# EAGLE design pin (EAGLE 8.2.1)
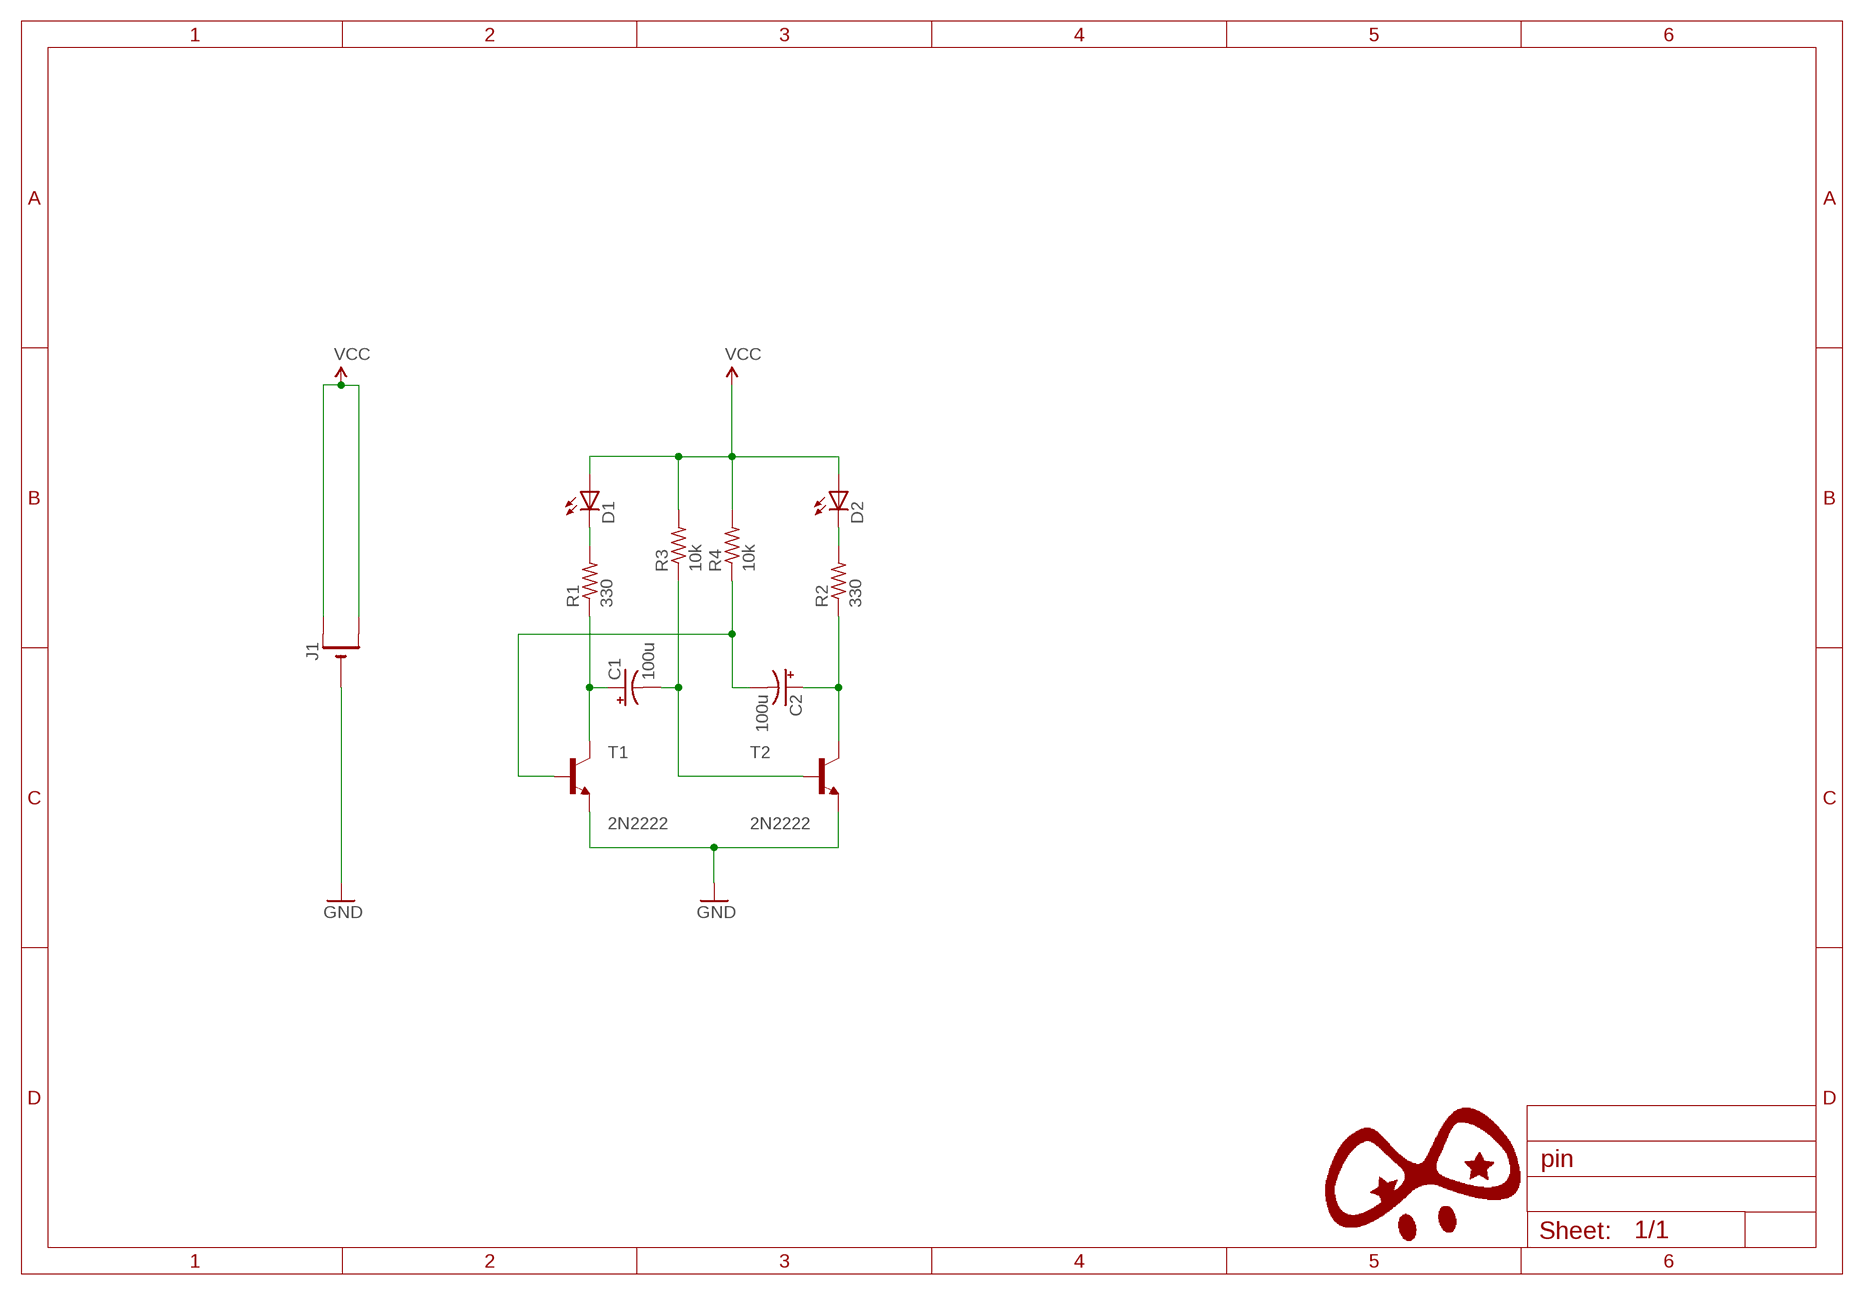
[diagram p0: schematic, sheet 1]

## Parts
C1  100u  CPOL-USE2-5  [E2-5]
C2  100u  CPOL-USE2-5  [E2-5]
D1  LED-3MM  [LED_3MM]
D2  LED-3MM  [LED_3MM]
J1  CR1220SMT  [CR1220-SMD]
R1  330  R-US_0204/5  [0204/5]
R2  330  R-US_0204/5  [0204/5]
R3  10k  R-US_0204/5  [0204/5]
R4  10k  R-US_0204/5  [0204/5]
T1  2N2222  [TO92-EBC-OVAL]
T2  2N2222  [TO92-EBC-OVAL]

## Nets
CP1: C1.+ R1.1 T1.C
GND: J1.- T1.E T2.E
N$3: C2.+ R2.1 T2.C
N$4: C1.- R3.1 T2.B
N$5: C2.- R4.1 T1.B
N$6: D1.C R1.2
N$7: D2.C R2.2
VCC: D1.A D2.A J1.+$1(+) J1.+$2(+1) R3.2 R4.2

## Library data of the parts
C1 C2 = adafruit:CPOL-US: POLARIZED CAPACITOR, American symbol
D1 D2 = Opto:LED: LEDs red, green, blue -> 0603
J1 = adafruit:CR1220: CR1216/CR1220/CR1225 12mm 3V lithium coin cell Great for battery packup. Both SMT and THM holders. Note the THM package has the ground pads on both sides of the PCB so that the masks are the same - this reduces the cost
R1-R4 = adafruit:R-US_: RESISTOR, American symbol
T1 T2 = adafruit:2N2222: NPN TRANSISTOR Big oval pads

## Net classes
0 default: clearance 0.254 mm

## Board
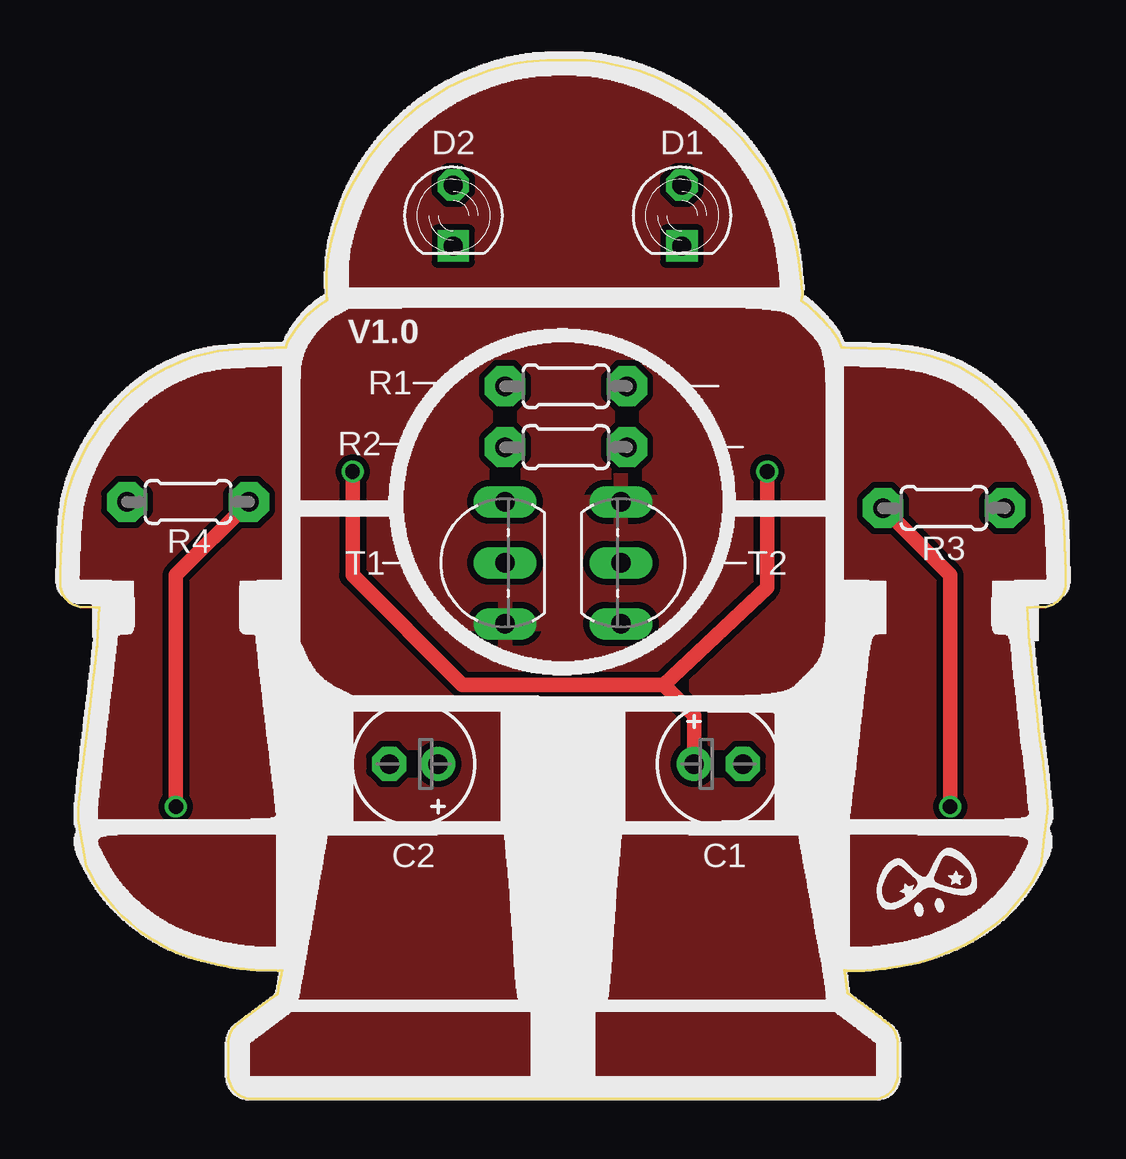
[diagram p1: board, top side]
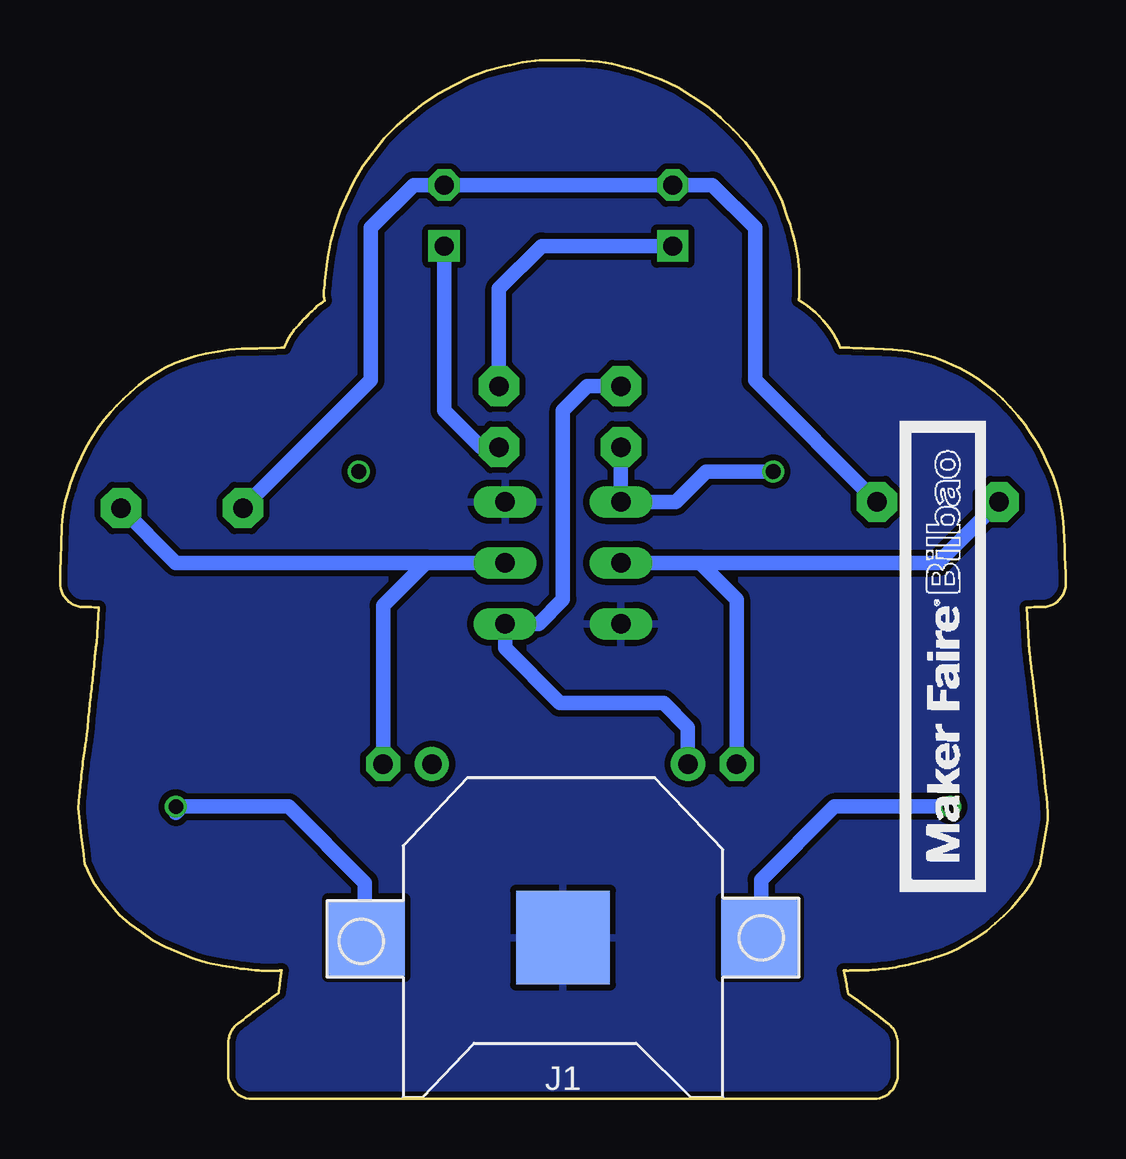
[diagram p2: board, bottom side, seen from below]

Size 41.92 x 43.31 mm. Coordinates in mm from the lower left corner, seen from the top.
Outline: 41.69,20.87 41.73,20.92 41.76,20.98 41.8,21.03 41.83,21.09 41.85,21.15 41.87,21.21 41.89,21.28 41.91,21.4 41.92,21.47 41.91,21.54 41.9,21.91 41.88,22.64 41.87,23.01 41.86,23.35 41.85,23.63 41.83,23.87 41.82,24.1 41.8,24.3 41.78,24.49 41.75,24.67 41.71,24.84 41.62,25.2 41.56,25.4 41.48,25.63 41.35,26.02 41.2,26.4 41.04,26.74 40.87,27.09 40.69,27.42 40.28,28.05 40.06,28.34 39.81,28.63 39.56,28.91 39.29,29.19 38.99,29.45 38.64,29.76 38.28,30.03 37.9,30.26 37.53,30.49 37.13,30.67 36.71,30.82 36.29,30.97 35.84,31.08 35.35,31.16 34.86,31.23 34.34,31.28 33.76,31.29 33.7,31.29 33.6,31.29 33.5,31.29 33.37,31.3 33.09,31.3 32.95,31.31 32.71,31.31 32.61,31.31 32.56,31.31 32.52,31.43 32.48,31.54 32.42,31.65 32.36,31.76 32.3,31.86 32.23,31.96 32.15,32.06 32.07,32.17 31.98,32.27 31.88,32.37 31.78,32.48 31.67,32.6 31.65,32.61 31.64,32.62 31.63,32.64 31.61,32.65 31.6,32.66 31.59,32.67 31.58,32.69 31.57,32.7 31.55,32.71 31.54,32.72 31.53,32.73 31.52,32.74 31.47,32.8 31.42,32.85 31.31,32.95 31.26,33 31.21,33.04 31.16,33.09 31.1,33.13 30.99,33.2 30.94,33.24 30.88,33.27 30.89,33.31 30.9,33.34 30.91,33.4 30.92,33.44 30.92,33.47 30.93,33.5 30.93,33.54 30.93,33.57 30.93,33.6 30.93,33.64 30.92,33.67 30.91,33.81 30.89,33.95 30.88,34.1 30.86,34.24 30.82,34.59 30.78,34.91 30.73,35.21 30.68,35.5 30.63,35.77 30.56,36.03 30.49,36.29 30.42,36.54 30.32,36.79 30.23,37.04 30.12,37.3 30,37.57 29.68,38.25 29.3,38.88 28.4,40.05 27.89,40.57 27.33,41.04 26.77,41.51 26.15,41.91 25.49,42.25 24.83,42.59 24.13,42.85 23.4,43.04 23.18,43.1 22.99,43.14 22.81,43.18 22.64,43.22 22.47,43.24 22.11,43.28 21.92,43.29 21.71,43.3 21.49,43.31 21.25,43.31 20.6,43.31 20.29,43.3 19.71,43.27 19.44,43.24 19.18,43.19 18.92,43.15 18.67,43.09 18.4,43.02 18.13,42.95 17.85,42.85 17.54,42.74 16.84,42.49 16.18,42.17 14.95,41.38 14.38,40.91 13.87,40.4 13.36,39.88 12.91,39.3 12.52,38.68 12.14,38.06 11.82,37.4 11.58,36.7 11.5,36.44 11.43,36.21 11.36,35.98 11.3,35.76 11.25,35.55 11.18,35.14 11.15,34.94 11.13,34.75 11.11,34.55 11.11,34.35 11.11,33.54 11.11,33.52 11.11,33.48 11.11,33.45 11.12,33.43 11.12,33.41 11.12,33.39 11.13,33.37 11.13,33.35 11.14,33.33 11.14,33.3 10.96,33.2 10.78,33.07 10.44,32.79 10.27,32.63 10.12,32.45 9.97,32.28 9.83,32.1 9.7,31.91 9.58,31.72 9.48,31.52 9.4,31.32 9.4,31.32 9.4,31.32 9.39,31.32 9.39,31.33 9.39,31.33 9.39,31.33 9.39,31.33 9.39,31.33 9.39,31.33 9.38,31.33 9.38,31.33 9.38,31.33 9.29,31.32 9.03,31.31 8.86,31.31 8.52,31.29 8.35,31.29 8.09,31.28 8,31.27 7.59,31.26 7.23,31.23 6.58,31.17 6.3,31.12 6.03,31.06 5.76,31 5.51,30.92 5.25,30.82 4.99,30.72 4.72,30.6 4.43,30.46 4.05,30.27 3.68,30.03 2.98,29.49 2.64,29.18 2.33,28.84 2.01,28.5 1.72,28.13 1.46,27.73 1.2,27.34 0.97,26.92 0.77,26.49 0.64,26.21 0.54,25.95 0.36,25.44 0.3,25.19 0.24,24.93 0.19,24.67 0.15,24.39 0.12,24.07 0.09,23.75 0.07,23.39 0.05,22.97 0.04,22.61 0.02,21.9 0,21.54 0,21.48 0,21.41 0.02,21.34 0.03,21.28 0.04,21.22 0.07,21.15 0.09,21.09 0.12,21.03 0.19,20.92 0.23,20.87 0.27,20.82 0.32,20.77 0.37,20.73 0.48,20.65 0.54,20.62 0.66,20.57 0.72,20.55 0.78,20.53 0.85,20.52 0.91,20.51 0.98,20.51 1.15,20.5 1.31,20.5 1.48,20.5 1.64,20.49 1.6,19.75 1.58,19.38 1.56,19.01 1.55,18.97 1.55,18.93 1.54,18.88 1.54,18.83 1.53,18.78 1.53,18.72 1.52,18.66 1.51,18.59 1.51,18.52 1.5,18.46 1.49,18.38 1.48,18.31 1.47,18.19 1.42,17.81 1.39,17.55 1.32,16.99 1.29,16.69 1.25,16.41 1.22,16.14 1.19,15.89 1.17,15.72 1.07,14.87 0.99,14.22 0.93,13.7 0.88,13.19 0.84,12.83 0.81,12.56 0.78,12.3 0.77,12.14 0.76,12.04 0.76,11.94 0.76,11.9 0.76,11.87 0.76,11.81 0.76,11.75 0.75,11.68 0.75,11.62 0.84,11.14 0.92,10.66 1.01,10.19 1.1,9.71 1.11,9.69 1.12,9.67 1.13,9.65 1.14,9.62 1.15,9.6 1.16,9.58 1.18,9.56 1.19,9.53 1.21,9.49 1.22,9.46 1.24,9.44 1.43,9.05 1.68,8.67 1.97,8.32 2.25,7.96 2.58,7.63 2.94,7.32 3.3,7.02 3.69,6.74 4.1,6.51 4.51,6.27 4.93,6.07 5.37,5.93 5.45,5.9 5.56,5.87 5.68,5.83 5.79,5.8 5.92,5.76 6.18,5.7 6.31,5.66 6.45,5.63 6.58,5.6 6.7,5.57 6.82,5.55 6.94,5.52 7.07,5.5 7.22,5.48 7.36,5.46 7.51,5.44 7.65,5.42 7.8,5.4 7.94,5.39 8.07,5.38 8.21,5.37 8.33,5.36 8.44,5.36 8.48,5.36 8.54,5.36 8.61,5.36 8.69,5.36 8.77,5.36 8.86,5.36 8.94,5.35 9,5.35 9.07,5.35 9.11,5.35 9.12,5.35 9.13,5.35 9.15,5.35 9.16,5.35 9.17,5.36 9.19,5.36 9.2,5.36 9.22,5.36 9.23,5.36 9.24,5.36 9.25,5.37 9.24,5.31 9.23,5.25 9.21,5.15 9.2,5.1 9.19,5.05 9.19,5.01 9.18,4.96 9.17,4.92 9.16,4.88 9.15,4.84 9.14,4.8 9.12,4.7 9.06,4.39 8.65,4.08 8.24,3.77 7.83,3.47 7.42,3.16 7.36,3.11 7.3,3.06 7.25,3 7.2,2.94 7.16,2.87 7.09,2.74 7.06,2.66 7.05,2.59 7.03,2.51 7.02,2.44 7.02,0.86 7.05,0.73 7.15,0.49 7.22,0.38 7.31,0.29 7.4,0.2 7.51,0.13 7.75,0.03 7.88,0 34.04,0 34.17,0.03 34.41,0.13 34.51,0.2 34.61,0.29 34.7,0.38 34.77,0.49 34.87,0.73 34.9,0.86 34.9,2.42 34.89,2.5 34.87,2.57 34.85,2.65 34.83,2.72 34.8,2.79 34.76,2.85 34.72,2.92 34.63,3.04 34.57,3.09 34.51,3.14 34.28,3.31 34.17,3.4 34.06,3.48 34,3.53 33.92,3.59 33.77,3.7 33.69,3.76 33.62,3.82 33.54,3.88 33.46,3.94 33.39,4 33.32,4.05 33.25,4.1 33.19,4.14 33.1,4.21 33,4.28 32.81,4.42 32.8,4.5 32.77,4.74 32.76,4.8 32.75,4.86 32.75,4.91 32.74,4.97 32.73,5.02 32.72,5.07 32.72,5.12 32.71,5.17 32.7,5.22 32.7,5.27 32.69,5.32 32.68,5.36 32.69,5.36 32.7,5.36 32.72,5.36 32.73,5.36 32.75,5.36 32.77,5.35 32.78,5.35 32.79,5.35 32.8,5.35 33.5,5.35 33.64,5.36 33.78,5.37 33.92,5.38 34.08,5.4 34.24,5.42 34.39,5.44 34.55,5.46 34.7,5.48 34.85,5.51 35,5.53 35.12,5.55 35.78,5.68 36.39,5.86 37.53,6.33 38.06,6.62 38.54,6.96 39.02,7.3 39.44,7.68 40.18,8.54 40.5,9.02 40.75,9.53 40.77,9.55 40.78,9.58 40.79,9.6 40.8,9.62 40.81,9.64 40.83,9.68 40.84,9.7 40.85,9.72 40.86,9.73 40.87,9.75 40.88,9.77 40.95,10.36 41.02,10.96 41.09,11.55 41.16,12.14 41.16,12.16 41.16,12.21 41.14,12.32 41.14,12.39 41.13,12.48 41.12,12.56 41.11,12.66 41.1,12.77 41.09,12.87 41.08,12.98 41.07,13.1 41.05,13.22 41.04,13.35 41.03,13.49 41.01,13.63 40.99,13.77 40.98,13.91 40.96,14.05 40.94,14.19 40.91,14.44 40.89,14.55 40.88,14.63 40.87,14.7 40.86,14.78 40.83,14.95 40.82,15.04 40.81,15.14 40.8,15.23 40.79,15.32 40.77,15.49 40.76,15.57 40.75,15.64 40.75,15.72 40.74,15.81 40.73,15.92 40.72,16.03 40.71,16.15 40.69,16.27 40.68,16.39 40.67,16.52 40.65,16.64 40.64,16.77 40.63,16.89 40.61,16.99 40.6,17.1 40.59,17.22 40.57,17.34 40.56,17.45 40.55,17.58 40.53,17.7 40.52,17.82 40.51,17.93 40.5,18.04 40.49,18.14 40.48,18.24 40.47,18.32 40.47,18.37 40.46,18.43 40.46,18.49 40.45,18.55 40.45,18.6 40.44,18.66 40.43,18.72 40.43,18.78 40.42,18.84 40.41,18.9 40.4,18.95 40.39,19.01 40.39,19.01 40.37,19.38 40.35,19.75 40.32,20.12 40.3,20.49 40.46,20.5 40.62,20.5 40.78,20.5 40.94,20.51 41,20.51 41.07,20.52 41.2,20.55 41.26,20.57 41.32,20.59 41.38,20.62 41.44,20.65 41.49,20.69 41.54,20.73 41.59,20.77 41.64,20.82
Copper layers (1*16): Top 0.035mm / dielectric 1.5mm / Bottom 0.035mm
Design rules "pighixxx_CAM_DRC_V1.0": minimum track width 6mil, minimum drill 12mil, track to track 6mil, track to pad 6mil, pad to pad 6mil, via to via 6mil, smd to smd 0mil, copper to edge 10mil, drill to drill 10mil, minimum pad ring 10mil, minimum via ring 6mil, stop-mask expansion 2mil, vias tented up to drill 100mil, thermal gap 10mil

### Footprints (pad centres in the part's own frame; a part is rotated, then mirrored left to right if it is on the bottom)
E2-5 = drill 0.813 pad 1.422: + -1.016,0 | drill 0.813 pad 1.422 octagon: - 1.016,0
LED_3MM = drill 0.8 pad 1.3 octagon: A 0,-1.27 | drill 0.8 pad 1.3 square: C 0,1.27
CR1220-SMD = smd 3.2 x 3.2: +$1 -8.2,0; +$2 8.2,0 | smd 3.9 x 3.9: - 0,0
0204/5 = drill 0.813 pad 1.676 octagon: 1 -2.54,0; 2 2.54,0
TO92-EBC-OVAL = drill 0.813 long: B 0,-1.27; C 2.54,-1.27; E -2.54,-1.27

### Placement (x,y rotation side)
C1  27.44,13.97 0 top
C2  14.74,13.97 180 top
D1  25.91,36.83 180 top
D2  16.39,36.83 180 top
J1  20.96,6.73 180 bottom
R1  21.09,27.17 0 top
R2  21.09,29.71 0 top
R3  36.83,24.63 180 top
R4  5.34,24.89 0 top
T1  17.28,22.35 90 top
T2  24.64,22.35 270 top
U$1  [ROBOT2]  -1.14,-0.26 0 top
U$3  [MFBILBAO]  3.05,8.38 90 bottom
U$5  [PIGHIXXX_LOGO]  34.04,7.62 0 top

### Tracks (layer width: path | path; a pad name or v marks a point on that pad's centre or on a via)
CP1  (via drill 0.61)
  Top 0.61: v12.2,26.16 12.2,21.84 16.77,17.27 25.15,17.27 | 25.15,17.27 29.47,21.33 v29.47,26.16 | 25.15,17.27 26.42,16 C1.+
  Bottom 0.61: v12.2,26.16 14.99,26.16 16.26,24.89 T1.C | 18.29,25.14 T1.C | R1.1 T1.C
GND
  pour Bottom: -1.27,-2.54 -1.27,44.45 42.93,44.45 42.93,-2.54
  pour Top: -1.27,-0.26 -1.27,44.45 43.44,44.45 43.44,-0.26
N$3
  Bottom 0.61: R2.1 19.94,29.71 20.96,28.7 20.96,20.82 21.97,19.81 T2.C 23.37,18.79 21.09,16.51 16.77,16.51 15.75,15.49 C2.+
N$4
  Bottom 0.61: R3.1 37.09,22.35 26.67,22.35 | 26.67,22.35 T2.B | 26.67,22.35 28.45,20.57 C1.-
N$5
  Bottom 0.61: R4.1 5.34,22.35 15.24,22.35 | 15.24,22.35 T1.B | 15.24,22.35 13.72,20.82 C2.-
N$6
  Bottom 0.61: R1.2 24.39,27.17 25.91,28.7 D1.C
N$7
  Bottom 0.61: D2.C 21.85,35.56 23.63,33.78 R2.2
VCC  (via drill 0.61)
  Top 0.61: v37.09,12.19 37.09,21.84 R3.2 | R4.2 4.83,21.84 v4.83,12.19
  Bottom 0.61: R4.2 12.96,29.97 12.96,36.32 14.74,38.1 D2.A D1.A 27.18,38.1 28.96,36.32 28.96,29.97 R3.2 | 36.96,12.06 37.09,11.93 v37.09,12.19 32.39,12.19 29.21,9.01 29.21,6.35 29.34,6.22 29.34,6.54 J1.+$2 | v4.83,12.19 9.66,12.19 12.7,9.14 12.7,6.78 J1.+$1

### Text on the board
tPlace: V1.0